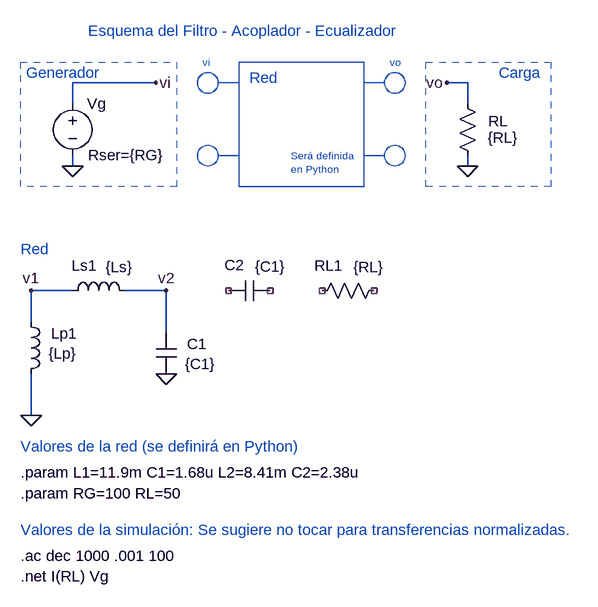
[diagram p0: schematic ltspice_equalizador_base.asc]
ltspice_equalizador_base.asc, the LTspice schematic file:
Version 4
SHEET 1 916 680
WIRE 160 -304 32 -304
WIRE 640 -304 608 -304
WIRE 32 -272 32 -304
WIRE 640 -272 640 -304
WIRE 32 -176 32 -192
WIRE 640 -176 640 -192
WIRE 32 16 -32 16
WIRE 176 16 112 16
WIRE -32 64 -32 16
WIRE 176 80 176 16
WIRE -32 208 -32 144
FLAG 32 -176 0
FLAG 640 -176 0
FLAG 160 -304 vi
FLAG 608 -304 vo
FLAG -32 208 0
FLAG -32 16 v1
FLAG 176 16 v2
FLAG 176 144 0
SYMBOL voltage 32 -288 R0
WINDOW 3 34 121 Invisible 2
WINDOW 39 24 95 Left 2
WINDOW 0 22 16 Left 2
SYMATTR Value 0
SYMATTR SpiceLine Rser={RG}
SYMATTR InstName Vg
SYMATTR Value2 AC 1 0
SYMBOL res 624 -288 R0
WINDOW 0 48 43 Left 2
WINDOW 3 47 68 Left 2
SYMATTR InstName RL
SYMATTR Value {RL}
SYMBOL ind -48 48 R0
WINDOW 0 47 34 Left 2
WINDOW 3 43 65 Left 2
SYMATTR InstName Lp1
SYMATTR Value {Lp}
SYMBOL ind 16 32 R270
WINDOW 0 39 34 VTop 2
WINDOW 3 68 88 VBottom 2
SYMATTR InstName Ls1
SYMATTR Value {Ls}
SYMBOL cap 160 80 R0
WINDOW 0 48 18 Left 2
WINDOW 3 45 49 Left 2
SYMATTR InstName C1
SYMATTR Value {C1}
SYMBOL cap 336 0 R90
WINDOW 0 -8 55 VBottom 2
WINDOW 3 -37 0 VTop 2
SYMATTR InstName C2
SYMATTR Value {C1}
SYMBOL res 512 0 R90
WINDOW 0 -7 86 VBottom 2
WINDOW 3 -36 24 VTop 2
SYMATTR InstName RL1
SYMATTR Value {RL}
TEXT -48 456 Left 2 !.net I(RL) Vg
TEXT -48 424 Left 2 !.ac dec 1000 .001 100
TEXT 304 -312 Left 2 ;Red
TEXT -40 -320 Left 2 ;Generador
TEXT 688 -320 Left 2 ;Carga
TEXT 368 -192 Left 1 ;Será definida \nen Python
TEXT -48 256 Left 2 ;Valores de la red (se definirá en Python)
TEXT -48 328 Left 2 !.param RG=100 RL=50
TEXT -48 296 Left 2 !.param L1=11.9m C1=1.68u L2=8.41m C2=2.38u
TEXT 56 -384 Left 2 ;Esquema del Filtro - Acoplador - Ecualizador
TEXT -48 384 Left 2 ;Valores de la simulación: Se sugiere no tocar para transferencias normalizadas.
TEXT -48 -48 Left 2 ;Red
TEXT 232 -336 Left 1 ;vi
TEXT 520 -336 Left 1 ;vo
LINE Normal 288 -304 256 -304
LINE Normal 288 -192 256 -192
LINE Normal 480 -192 512 -192
LINE Normal 480 -304 512 -304
RECTANGLE Normal 480 -144 288 -336
RECTANGLE Normal 768 -144 576 -336 2
RECTANGLE Normal 192 -144 -48 -336 2
CIRCLE Normal 256 -288 224 -320
CIRCLE Normal 256 -176 224 -208
CIRCLE Normal 512 -208 544 -176
CIRCLE Normal 512 -320 544 -288

The netlist it stands for:
* ltspice_equalizador_base.asc
Vg vi 0 0 AC 1 0 Rser={RG}
RL vo 0 {RL}
Lp1 v1 0 {Lp}
Ls1 v1 v2 {Ls}
C1 v2 0 {C1}
C2 NC_01 NC_02 {C1}
RL1 NC_03 NC_04 {RL}
.net I(RL) Vg
.ac dec 1000 .001 100
* Red
* Generador
* Carga
* Será definida
* en Python
* Valores de la red (se definirá en Python)
.param RG=100 RL=50
.param L1=11.9m C1=1.68u L2=8.41m C2=2.38u
* Esquema del Filtro - Acoplador - Ecualizador
* Valores de la simulación: Se sugiere no tocar para transferencias normalizadas.
* Red
* vi
* vo
.backanno
.end